# EAGLE schematic MikesLEDMatrix (EAGLE 5.12)
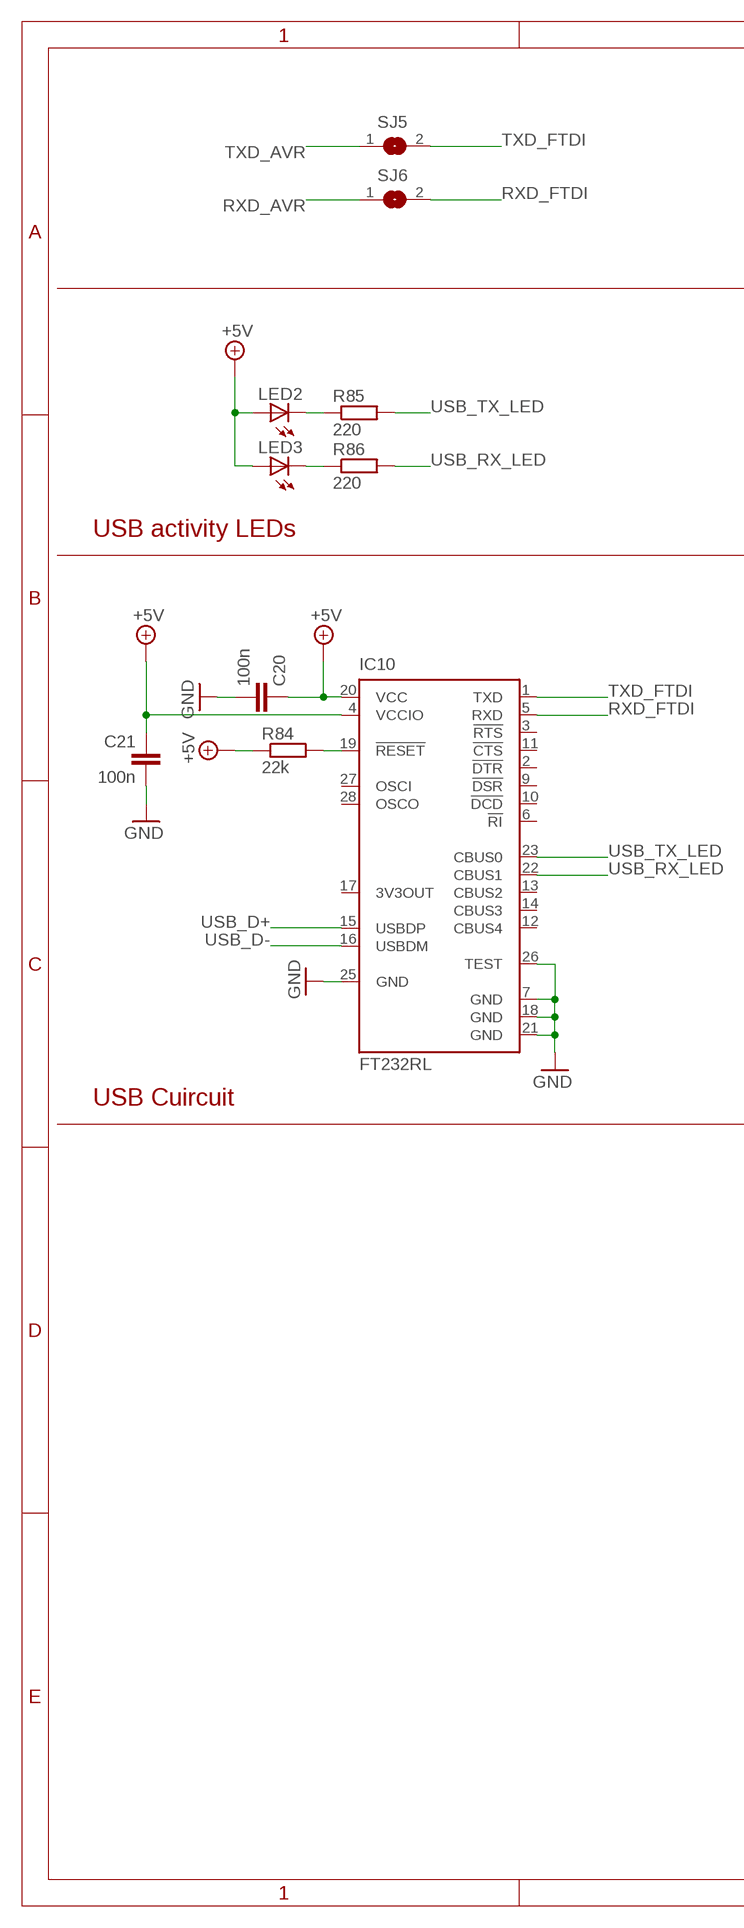
[diagram p0: schematic, sheet 1, part 1 of 2]
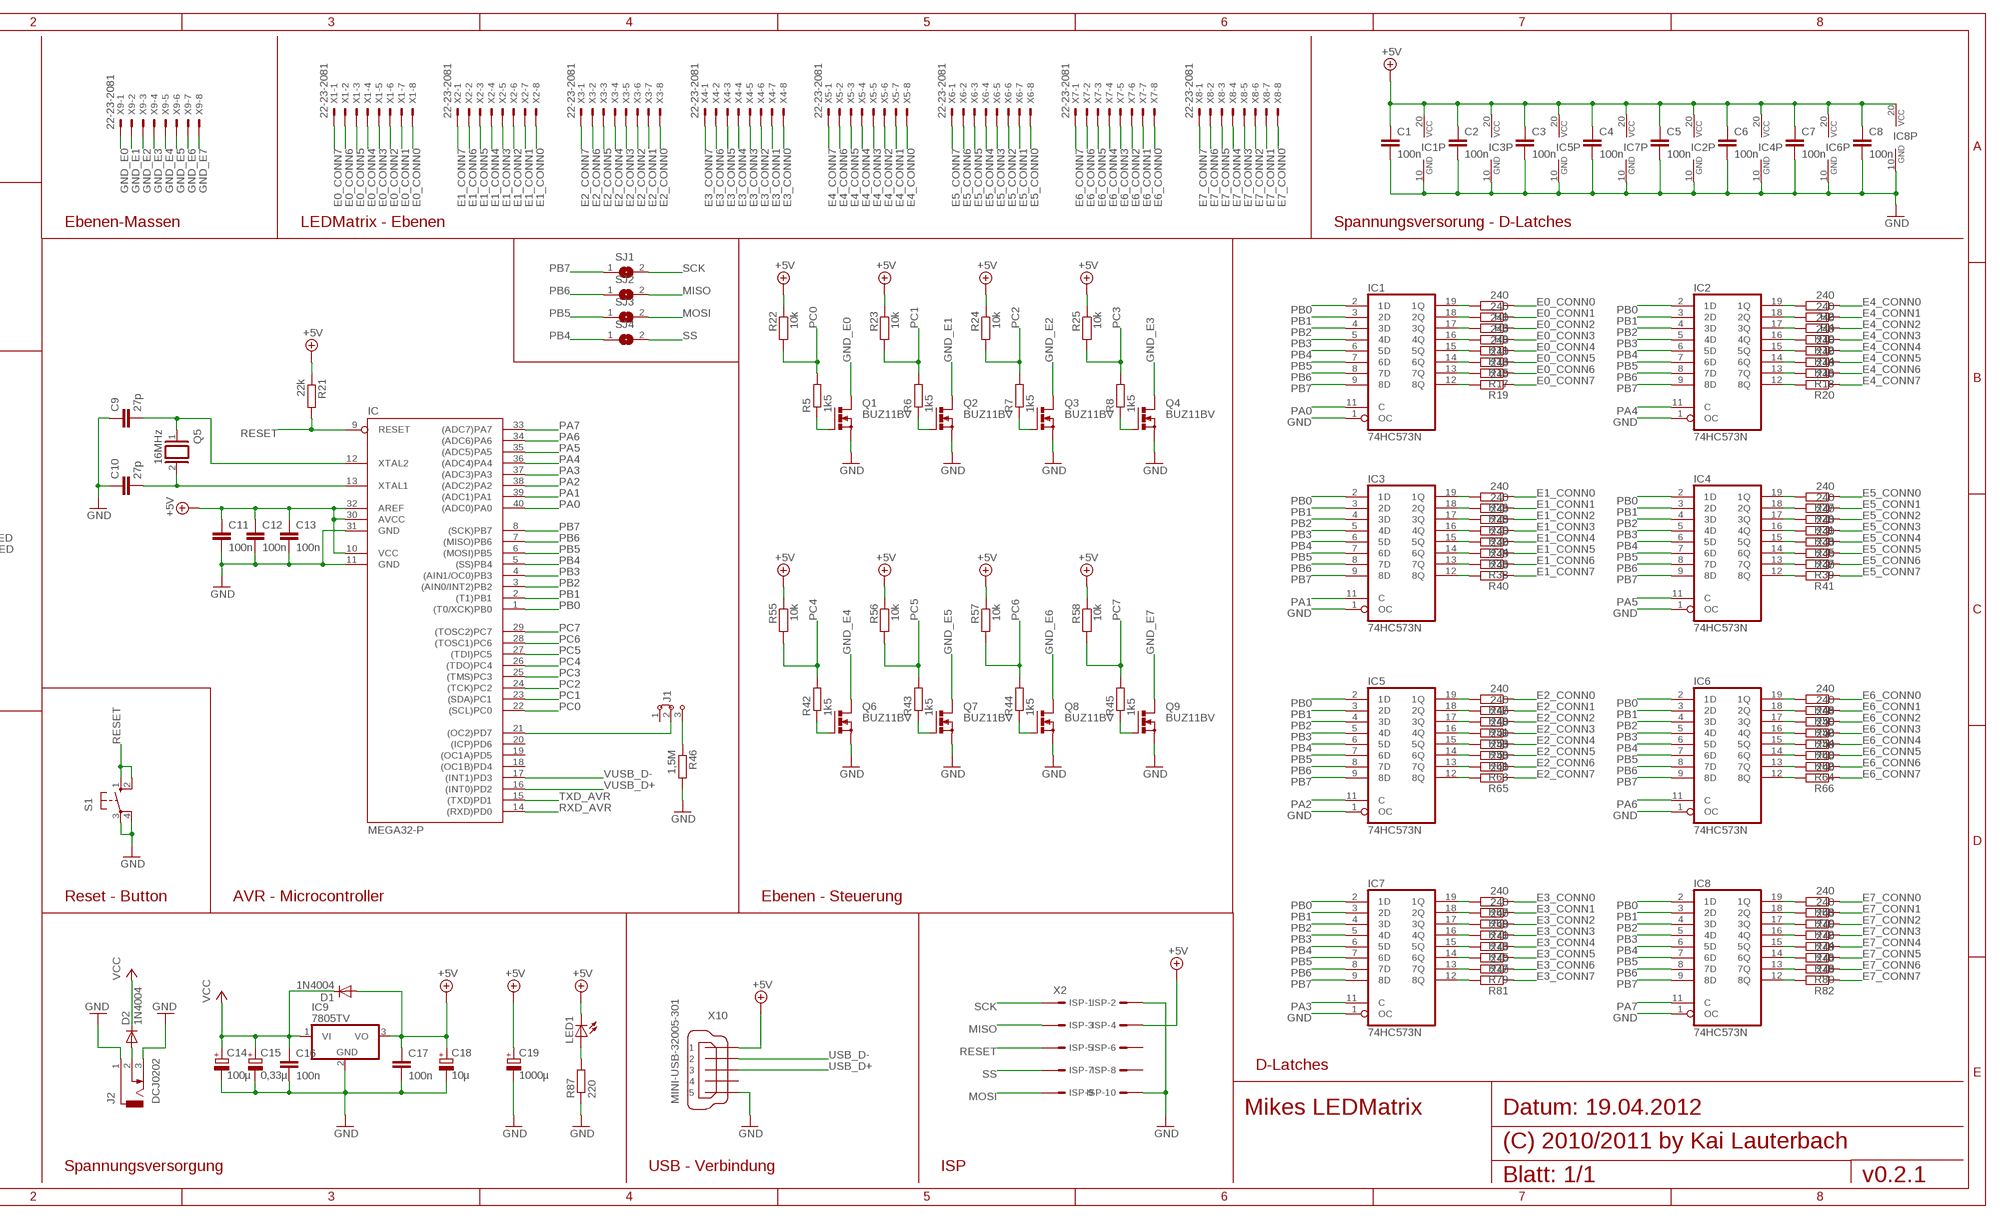
[diagram p1: schematic, sheet 1, part 2 of 2]

## Parts
C1  100n  C-EUC1206  [C1206]
C2  100n  C-EUC1206  [C1206]
C3  100n  C-EUC1206  [C1206]
C4  100n  C-EUC1206  [C1206]
C5  100n  C-EUC1206  [C1206]
C6  100n  C-EUC1206  [C1206]
C7  100n  C-EUC1206  [C1206]
C8  100n  C-EUC1206  [C1206]
C9  27p  C-EUC1206  [C1206]
C10  27p  C-EUC1206  [C1206]
C11  100n  C-EUC1206  [C1206]
C12  100n  C-EUC1206  [C1206]
C13  100n  C-EUC1206  [C1206]
C14  100µ  CPOL-EUE1.8-4  [E1,8-4]
C15  0,33µ  CPOL-EUE1.8-4  [E1,8-4]
C16  100n  C-EUC1206  [C1206]
C17  100n  C-EUC1206  [C1206]
C18  10µ  CPOL-EUE1.8-4  [E1,8-4]
C19  1000µ  CPOL-EUE1.8-4  [E1,8-4]
C20  100n  C-EUC1206  [C1206]
C21  100n  C-EUC1206  [C1206]
D1  1N4004  [DO41-10]
D2  1N4004  [DO41-10]
IC  MEGA32-P  [DIL40]
IC1  74HC573N  [DIL20]
IC2  74HC573N  [DIL20]
IC3  74HC573N  [DIL20]
IC4  74HC573N  [DIL20]
IC5  74HC573N  [DIL20]
IC6  74HC573N  [DIL20]
IC7  74HC573N  [DIL20]
IC8  74HC573N  [DIL20]
IC9  7805TV  [TO220V]
IC10  FT232RL  [SSOP28]
ISP  X2  057-010-1  [057-010-1]
J1  J2X2MM  [04C]
J2  DCJ0202  [DCJ0202]
LED1  LED3MM  [LED3MM]
LED2  LED3MM  [LED3MM]
LED3  LED3MM  [LED3MM]
Q1  BUZ11BV  [TO220BV]
Q2  BUZ11BV  [TO220BV]
Q3  BUZ11BV  [TO220BV]
Q4  BUZ11BV  [TO220BV]
Q5  16MHz  XTAL/S  [QS]
Q6  BUZ11BV  [TO220BV]
Q7  BUZ11BV  [TO220BV]
Q8  BUZ11BV  [TO220BV]
Q9  BUZ11BV  [TO220BV]
R1  240  R-EU_M1206  [M1206]
R2  240  R-EU_M1206  [M1206]
R3  240  R-EU_M1206  [M1206]
R4  240  R-EU_M1206  [M1206]
R5  1k5  R-EU_M1206  [M1206]
R6  1k5  R-EU_M1206  [M1206]
R7  1k5  R-EU_M1206  [M1206]
R8  1k5  R-EU_M1206  [M1206]
R9  240  R-EU_M1206  [M1206]
R10  240  R-EU_M1206  [M1206]
R11  240  R-EU_M1206  [M1206]
R12  240  R-EU_M1206  [M1206]
R13  240  R-EU_M1206  [M1206]
R14  240  R-EU_M1206  [M1206]
R15  240  R-EU_M1206  [M1206]
R16  240  R-EU_M1206  [M1206]
R17  240  R-EU_M1206  [M1206]
R18  240  R-EU_M1206  [M1206]
R19  240  R-EU_M1206  [M1206]
R20  240  R-EU_M1206  [M1206]
R21  22k  R-EU_M1206  [M1206]
R22  10k  R-EU_M1206  [M1206]
R23  10k  R-EU_M1206  [M1206]
R24  10k  R-EU_M1206  [M1206]
R25  10k  R-EU_M1206  [M1206]
R26  240  R-EU_M1206  [M1206]
R27  240  R-EU_M1206  [M1206]
R28  240  R-EU_M1206  [M1206]
R29  240  R-EU_M1206  [M1206]
R30  240  R-EU_M1206  [M1206]
R31  240  R-EU_M1206  [M1206]
R32  240  R-EU_M1206  [M1206]
R33  240  R-EU_M1206  [M1206]
R34  240  R-EU_M1206  [M1206]
R35  240  R-EU_M1206  [M1206]
R36  240  R-EU_M1206  [M1206]
R37  240  R-EU_M1206  [M1206]
R38  240  R-EU_M1206  [M1206]
R39  240  R-EU_M1206  [M1206]
R40  240  R-EU_M1206  [M1206]
R41  240  R-EU_M1206  [M1206]
R42  1k5  R-EU_M1206  [M1206]
R43  1k5  R-EU_M1206  [M1206]
R44  1k5  R-EU_M1206  [M1206]
R45  1k5  R-EU_M1206  [M1206]
R46  1,5M  R-EU_M1206  [M1206]
R47  240  R-EU_M1206  [M1206]
R48  240  R-EU_M1206  [M1206]
R49  240  R-EU_M1206  [M1206]
R50  240  R-EU_M1206  [M1206]
R51  240  R-EU_M1206  [M1206]
R52  240  R-EU_M1206  [M1206]
R53  240  R-EU_M1206  [M1206]
R54  240  R-EU_M1206  [M1206]
R55  10k  R-EU_M1206  [M1206]
R56  10k  R-EU_M1206  [M1206]
R57  10k  R-EU_M1206  [M1206]
R58  10k  R-EU_M1206  [M1206]
R59  240  R-EU_M1206  [M1206]
R60  240  R-EU_M1206  [M1206]
R61  240  R-EU_M1206  [M1206]
R62  240  R-EU_M1206  [M1206]
R63  240  R-EU_M1206  [M1206]
R64  240  R-EU_M1206  [M1206]
R65  240  R-EU_M1206  [M1206]
R66  240  R-EU_M1206  [M1206]
R67  240  R-EU_M1206  [M1206]
R68  240  R-EU_M1206  [M1206]
R69  240  R-EU_M1206  [M1206]
R70  240  R-EU_M1206  [M1206]
R71  240  R-EU_M1206  [M1206]
R72  240  R-EU_M1206  [M1206]
R73  240  R-EU_M1206  [M1206]
R74  240  R-EU_M1206  [M1206]
R75  240  R-EU_M1206  [M1206]
R76  240  R-EU_M1206  [M1206]
R77  240  R-EU_M1206  [M1206]
R78  240  R-EU_M1206  [M1206]
R79  240  R-EU_M1206  [M1206]
R80  240  R-EU_M1206  [M1206]
R81  240  R-EU_M1206  [M1206]
R82  240  R-EU_M1206  [M1206]
R84  22k  R-EU_M1206  [M1206]
R85  220  R-EU_M1206  [M1206]
R86  220  R-EU_M1206  [M1206]
R87  220  R-EU_M1206  [M1206]
S1  10-XX  [B3F-10XX]
SJ1  SJ  [SJ]
SJ2  SJ  [SJ]
SJ3  SJ  [SJ]
SJ4  SJ  [SJ]
SJ5  SJ  [SJ]
SJ6  SJ  [SJ]
X1  22-23-2081  [22-23-2081]
X2  22-23-2081  [22-23-2081]
X3  22-23-2081  [22-23-2081]
X4  22-23-2081  [22-23-2081]
X5  22-23-2081  [22-23-2081]
X6  22-23-2081  [22-23-2081]
X7  22-23-2081  [22-23-2081]
X8  22-23-2081  [22-23-2081]
X9  22-23-2081  [22-23-2081]
X10  MINI-USB-32005-301  [32005-301]

## Nets
+5V: C1.1 C2.1 C3.1 C4.1 C5.1 C6.1 C7.1 C8.1 C11.1 C12.1 C13.1 C17.1 C18.+ C19.+ C20.1 C21.1 D1.A IC1.20(VCC) IC2.20(VCC) IC3.20(VCC) IC4.20(VCC) IC5.20(VCC) IC6.20(VCC) IC7.20(VCC) IC8.20(VCC) IC9.3(VO) IC10.4(VCCIO) IC10.20(VCC) IC.10(VCC) IC.30(AVCC) IC.32(AREF) ISP.4 LED1.K(C) LED2.A LED3.A R21.1 R22.1 R23.1 R24.1 R25.1 R55.1 R56.1 R57.1 R58.1 R84.1 X10.1
E0_CONN0: R1.1 X1.8
E0_CONN1: R3.1 X1.7
E0_CONN2: R9.1 X1.6
E0_CONN3: R11.1 X1.5
E0_CONN4: R13.1 X1.4
E0_CONN5: R15.1 X1.3
E0_CONN6: R17.1 X1.2
E0_CONN7: R19.1 X1.1
E1_CONN0: R26.1 X2.8
E1_CONN1: R28.1 X2.7
E1_CONN2: R30.1 X2.6
E1_CONN3: R32.1 X2.5
E1_CONN4: R34.1 X2.4
E1_CONN5: R36.1 X2.3
E1_CONN6: R38.1 X2.2
E1_CONN7: R40.1 X2.1
E2_CONN0: R47.1 X3.8
E2_CONN1: R49.1 X3.7
E2_CONN2: R51.1 X3.6
E2_CONN3: R53.1 X3.5
E2_CONN4: R59.1 X3.4
E2_CONN5: R61.1 X3.3
E2_CONN6: R63.1 X3.2
E2_CONN7: R65.1 X3.1
E3_CONN0: R67.1 X4.8
E3_CONN1: R69.1 X4.7
E3_CONN2: R71.1 X4.6
E3_CONN3: R73.1 X4.5
E3_CONN4: R75.1 X4.4
E3_CONN5: R77.1 X4.3
E3_CONN6: R79.1 X4.2
E3_CONN7: R81.1 X4.1
E4_CONN0: R2.1 X5.8
E4_CONN1: R4.1 X5.7
E4_CONN2: R10.1 X5.6
E4_CONN3: R12.1 X5.5
E4_CONN4: R14.1 X5.4
E4_CONN5: R16.1 X5.3
E4_CONN6: R18.1 X5.2
E4_CONN7: R20.1 X5.1
E5_CONN0: R27.1 X6.8
E5_CONN1: R29.1 X6.7
E5_CONN2: R31.1 X6.6
E5_CONN3: R33.1 X6.5
E5_CONN4: R35.1 X6.4
E5_CONN5: R37.1 X6.3
E5_CONN6: R39.1 X6.2
E5_CONN7: R41.1 X6.1
E6_CONN0: R48.1 X7.8
E6_CONN1: R50.1 X7.7
E6_CONN2: R52.1 X7.6
E6_CONN3: R54.1 X7.5
E6_CONN4: R60.1 X7.4
E6_CONN5: R62.1 X7.3
E6_CONN6: R64.1 X7.2
E6_CONN7: R66.1 X7.1
E7_CONN0: R68.1 X8.8
E7_CONN1: R70.1 X8.7
E7_CONN2: R72.1 X8.6
E7_CONN3: R74.1 X8.5
E7_CONN4: R76.1 X8.4
E7_CONN5: R78.1 X8.3
E7_CONN6: R80.1 X8.2
E7_CONN7: R82.1 X8.1
GND: C1.2 C2.2 C3.2 C4.2 C5.2 C6.2 C7.2 C8.2 C9.1 C10.1 C11.2 C12.2 C13.2 C14.- C15.- C16.2 C17.2 C18.- C19.- C20.2 C21.2 IC1.1(OC) IC1.10(GND) IC2.1(OC) IC2.10(GND) IC3.1(OC) IC3.10(GND) IC4.1(OC) IC4.10(GND) IC5.1(OC) IC5.10(GND) IC6.1(OC) IC6.10(GND) IC7.1(OC) IC7.10(GND) IC8.1(OC) IC8.10(GND) IC9.2(GND) IC10.7(GND) IC10.18(GND) IC10.21(GND) IC10.25(GND) IC10.26(TEST) IC.11(GND) IC.31(GND) ISP.2 ISP.10 J2.1 J2.3 Q1.S Q2.S Q3.S Q4.S Q6.S Q7.S Q8.S Q9.S R46.2 R87.1 S1.3(P) S1.4(P1) X10.5
GND_E0: Q1.D X9.1
GND_E1: Q2.D X9.2
GND_E2: Q3.D X9.3
GND_E3: Q4.D X9.4
GND_E4: Q6.D X9.5
GND_E5: Q7.D X9.6
GND_E6: Q8.D X9.7
GND_E7: Q9.D X9.8
MISO: ISP.3 SJ2.2
MOSI: ISP.9 SJ3.2
N$1: C10.2 IC.13(XTAL1) Q5.2
N$2: IC.21((OC2)PD7) J1.2
N$3: C9.2 IC.12(XTAL2) Q5.1
N$4: J1.3 R46.1
N$5: IC10.19(!RESET) R84.2
N$6: D2.A J2.2
N$7: LED1.A R87.2
N$8: Q1.G R5.1
N$10: Q2.G R6.1
N$11: Q3.G R7.1
N$12: Q4.G R8.1
N$13: Q6.G R42.1
N$14: Q7.G R43.1
N$15: Q8.G R44.1
N$16: Q9.G R45.1
N$17: IC1.19(1Q) R1.2
N$18: IC1.18(2Q) R3.2
N$19: IC1.17(3Q) R9.2
N$20: IC1.16(4Q) R11.2
N$21: IC1.15(5Q) R13.2
N$22: IC1.14(6Q) R15.2
N$23: IC1.13(7Q) R17.2
N$24: IC1.12(8Q) R19.2
N$25: IC3.19(1Q) R26.2
N$26: IC3.18(2Q) R28.2
N$27: IC3.17(3Q) R30.2
N$28: IC3.16(4Q) R32.2
N$29: IC3.15(5Q) R34.2
N$30: IC3.14(6Q) R36.2
N$31: IC3.13(7Q) R38.2
N$32: IC3.12(8Q) R40.2
N$33: IC5.19(1Q) R47.2
N$34: IC5.18(2Q) R49.2
N$35: IC5.17(3Q) R51.2
N$36: IC5.16(4Q) R53.2
N$37: IC5.15(5Q) R59.2
N$38: IC5.14(6Q) R61.2
N$39: IC5.13(7Q) R63.2
N$40: IC5.12(8Q) R65.2
N$41: IC7.19(1Q) R67.2
N$42: IC7.18(2Q) R69.2
N$43: IC7.17(3Q) R71.2
N$44: IC7.16(4Q) R73.2
N$45: IC7.15(5Q) R75.2
N$46: IC7.14(6Q) R77.2
N$47: IC7.13(7Q) R79.2
N$48: IC7.12(8Q) R81.2
N$49: IC2.19(1Q) R2.2
N$50: IC2.18(2Q) R4.2
N$51: IC2.17(3Q) R10.2
N$52: IC2.16(4Q) R12.2
N$53: IC2.15(5Q) R14.2
N$54: IC2.14(6Q) R16.2
N$55: IC2.13(7Q) R18.2
N$56: IC2.12(8Q) R20.2
N$57: IC4.19(1Q) R27.2
N$58: IC4.18(2Q) R29.2
N$59: IC4.17(3Q) R31.2
N$60: IC4.16(4Q) R33.2
N$61: IC4.15(5Q) R35.2
N$62: IC4.14(6Q) R37.2
N$63: IC4.13(7Q) R39.2
N$64: IC4.12(8Q) R41.2
N$65: IC6.19(1Q) R48.2
N$66: IC6.18(2Q) R50.2
N$67: IC6.17(3Q) R52.2
N$68: IC6.16(4Q) R54.2
N$69: IC6.15(5Q) R60.2
N$70: IC6.14(6Q) R62.2
N$71: IC6.13(7Q) R64.2
N$72: IC6.12(8Q) R66.2
N$73: IC8.19(1Q) R68.2
N$74: IC8.18(2Q) R70.2
N$75: IC8.17(3Q) R72.2
N$76: IC8.16(4Q) R74.2
N$77: IC8.15(5Q) R76.2
N$78: IC8.14(6Q) R78.2
N$79: IC8.13(7Q) R80.2
N$80: IC8.12(8Q) R82.2
N$82: LED2.K(C) R85.1
N$83: LED3.K(C) R86.1
PA0: IC1.11(C) IC.40((ADC0)PA0)
PA1: IC3.11(C) IC.39((ADC1)PA1)
PA2: IC5.11(C) IC.38((ADC2)PA2)
PA3: IC7.11(C) IC.37((ADC3)PA3)
PA4: IC2.11(C) IC.36((ADC4)PA4)
PA5: IC4.11(C) IC.35((ADC5)PA5)
PA6: IC6.11(C) IC.34((ADC6)PA6)
PA7: IC8.11(C) IC.33((ADC7)PA7)
PB0: IC1.2(1D) IC2.2(1D) IC3.2(1D) IC4.2(1D) IC5.2(1D) IC6.2(1D) IC7.2(1D) IC8.2(1D) IC.1((T0/XCK)PB0)
PB1: IC1.3(2D) IC2.3(2D) IC3.3(2D) IC4.3(2D) IC5.3(2D) IC6.3(2D) IC7.3(2D) IC8.3(2D) IC.2((T1)PB1)
PB2: IC1.4(3D) IC2.4(3D) IC3.4(3D) IC4.4(3D) IC5.4(3D) IC6.4(3D) IC7.4(3D) IC8.4(3D) IC.3((AIN0/INT2)PB2)
PB3: IC1.5(4D) IC2.5(4D) IC3.5(4D) IC4.5(4D) IC5.5(4D) IC6.5(4D) IC7.5(4D) IC8.5(4D) IC.4((AIN1/OC0)PB3)
PB4: IC1.6(5D) IC2.6(5D) IC3.6(5D) IC4.6(5D) IC5.6(5D) IC6.6(5D) IC7.6(5D) IC8.6(5D) IC.5((SS)PB4) SJ4.1
PB5: IC1.7(6D) IC2.7(6D) IC3.7(6D) IC4.7(6D) IC5.7(6D) IC6.7(6D) IC7.7(6D) IC8.7(6D) IC.6((MOSI)PB5) SJ3.1
PB6: IC1.8(7D) IC2.8(7D) IC3.8(7D) IC4.8(7D) IC5.8(7D) IC6.8(7D) IC7.8(7D) IC8.8(7D) IC.7((MISO)PB6) SJ2.1
PB7: IC1.9(8D) IC2.9(8D) IC3.9(8D) IC4.9(8D) IC5.9(8D) IC6.9(8D) IC7.9(8D) IC8.9(8D) IC.8((SCK)PB7) SJ1.1
PC0: IC.22((SCL)PC0) R5.2 R22.2
PC1: IC.23((SDA)PC1) R6.2 R23.2
PC2: IC.24((TCK)PC2) R7.2 R24.2
PC3: IC.25((TMS)PC3) R8.2 R25.2
PC4: IC.26((TDO)PC4) R42.2 R55.2
PC5: IC.27((TDI)PC5) R43.2 R56.2
PC6: IC.28((TOSC1)PC6) R44.2 R57.2
PC7: IC.29((TOSC2)PC7) R45.2 R58.2
RESET: IC.9(RESET) ISP.5 R21.2 S1.1(S) S1.2(S1)
RXD_AVR: IC.14((RXD)PD0) SJ6.1
RXD_FTDI: IC10.5(RXD) SJ6.2
SCK: ISP.1 SJ1.2
SS: ISP.7 SJ4.2
TXD_AVR: IC.15((TXD)PD1) SJ5.1
TXD_FTDI: IC10.1(TXD) SJ5.2
USB_D+: IC10.15(USBDP) X10.3
USB_D-: IC10.16(USBDM) X10.2
USB_RX_LED: IC10.22(CBUS1) R86.2
USB_TX_LED: IC10.23(CBUS0) R85.2
VCC: C14.+ C15.+ C16.1 D1.C D2.C IC9.1(VI)
VUSB_D+: IC.16((INT0)PD2)
VUSB_D-: IC.17((INT1)PD3)
Unconnected: IC10.2(!DTR) IC10.3(!RTS) IC10.6(!RI) IC10.9(!DSR) IC10.10(!DCD) IC10.11(!CTS) IC10.12(CBUS4) IC10.13(CBUS2) IC10.14(CBUS3) IC10.17(3V3OUT) IC10.27(OSCI) IC10.28(OSCO) IC.18((OC1B)PD4) IC.19((OC1A)PD5) IC.20((ICP)PD6) ISP.6 ISP.8 J1.1 X10.4

## Notes on the sheet
- Ebenen-Massen | LEDMatrix - Ebenen | Spannungsversorung - D-Latches
- USB activity LEDs
- USB Cuircuit
- Reset - Button | AVR - Microcontroller | Ebenen - Steuerung
- D-Latches
- Mikes LEDMatrix | Datum: 19.04.2012
- (C) 2010/2011 by Kai Lauterbach
- Spannungsversorgung | USB - Verbindung | ISP
- Blatt: 1/1 | v0.2.1

## Library data of the parts
C1-C13 C16 C17 C20 C21 = rcl:C-EU: CAPACITOR, European symbol
C14 C15 C18 C19 = resistor:CPOL-EU: POLARIZED CAPACITOR, European symbol
D1 D2 = diode:1N4004: DIODE general purpose rectifier, 1 A
IC = atmel:MEGA32-P: MICROCONTROLLER 32 Kbytes FLASH 2 Kbytes SRAM 1 Kbytes EEPROM USART 8-channel 10 bit ADC Source: www.atmel.com .. doc2503.pdf; MPN: ATMEGA32-16PU; OC_FARNELL: 1661729; OC_NEWARK: 51P1794
IC1-IC8 = 74xx-eu:74*573: 8-bit D latch BUS DRIVER
IC9 = linear:78*: Positive VOLTAGE REGULATOR Source: http://cache.national.com/ds/LM/LM78L05.pdf http://www.fairchildsemi.com/ds/LM/LM7805.pdf
IC10 = ftdichip:FT232R: Source: http://www.ftdichip.com/Documents/DataSheets/DS_FT232R_v104.pdf; MPN: FT232RL; OC_FARNELL: 1146032; OC_NEWARK: 91K9918
ISP = con-panduit:057-010-: CONNECTOR 10-pin series 057 contact pc board low profile headers; OC_FARNELL: unknown; OC_NEWARK: unknown
J1 = jumper:J2: Jumper switch 2 x 2.5 mm
J2 = con-jack:DCJ0202: DC POWER JACK Source: DCJ0202.pdf; OC_FARNELL: unknown; OC_NEWARK: unknown
LED1-LED3 = led:LED: LED OSRAM: - CHIPLED LG R971, LG N971, LY N971, LG Q971, LY Q971, LO R971, LY R971 LH N974, LH R974 LS Q976, LO Q976, LY Q976 LO Q996 - Hyper CHIPLED LW Q18S LB Q993, LB Q99A, LB R99A - SideLED LS A670, LO A670, LY A670, LG A670, LP A670 LB A673, LV A673, LT A673, LW A673 LH A674 LY A675 LS A676, LA A676, LO A676, LY A676, LW A676 LS A679, LY A679, LG A679 - Hyper Micro SIDELED® LS Y876, LA Y876, LO Y876, LY Y876 LT Y87S - SmartLED LW L88C, LW L88S LB L89C, LB L89S, LG L890 LS L89K, LO L89K, LY L89K LS L896, LA L896, LO L896, LY L896 - TOPLED LS T670, LO T670, LY T670, LG T670, LP T670 LSG T670, LSP T670, LSY T670, LOP T670, LYG T670 LG T671, LOG T671, LSG T671 LB T673, LV T673, LT T673, LW T673 LH T674 LS T676, LA T676, LO T676, LY T676, LB T676, LH T676, LSB T676, LW T676 LB T67C, LV T67C, LT T67C, LS T67K, LO T67K, LY T67K, LW E67C LS E67B, LA E67B, LO E67B, LY E67B, LB E67C, LV E67C, LT E67C LW T67C LS T679, LY T679, LG T679 LS T770, LO T770, LY T770, LG T770, LP T770 LB T773, LV T773, LT T773, LW T773 LH T774 LS E675, LA E675, LY E675, LS T675 LS T776, LA T776, LO T776, LY T776, LB T776 LHGB T686 LT T68C, LB T68C - Hyper Mini TOPLED® LB M676 - Mini TOPLED Santana® LG M470 LS M47K, LO M47K, LY M47K Source: http://www.osram.convergy.de LUXEON: - LUMILED® LXK2-PW12-R00, LXK2-PW12-S00, LXK2-PW14-U00, LXK2-PW14-V00 LXK2-PM12-R00, LXK2-PM12-S00, LXK2-PM14-U00 LXK2-PE12-Q00, LXK2-PE12-R00, LXK2-PE12-S00, LXK2-PE14-T00, LXK2-PE14-U00 LXK2-PB12-K00, LXK2-PB12-L00, LXK2-PB12-M00, LXK2-PB14-N00, LXK2-PB14-P00, LXK2-PB14-Q00 LXK2-PR12-L00, LXK2-PR12-M00, LXK2-PR14-Q00, LXK2-PR14-R00 LXK2-PD12-Q00, LXK2-PD12-R00, LXK2-PD12-S00 LXK2-PH12-R00, LXK2-PH12-S00 LXK2-PL12-P00, LXK2-PL12-Q00, LXK2-PL12-R00 Source: www.luxeon.com KINGBRIGHT: KA-3528ASYC Source: www.kingbright.com
Q1-Q4 Q6-Q9 = transistor-power:BUZ11: N-CHANNEL MOS FET
Q5 = special:XTAL/S: CRYSTAL
R1-R82 R87 = rcl:R-EU_: RESISTOR, European symbol
R84-R86 = resistor:R-EU_: RESISTOR, European symbol
S1 = switch-omron:10-XX: OMRON SWITCH; MPN: B3F-1000; OC_FARNELL: 176432; OC_NEWARK: 36M3542
SJ1-SJ6 = jumper:SJ: SMD solder JUMPER
X1-X9 = con-molex:22-23-2081: .100" (2.54mm) Center Header - 8 Pin; MF: MOLEX; MPN: 22-23-2081; OC_FARNELL: 1756826; OC_NEWARK: 01C7592
X10 = con-cypressindustries:MINI-USB-: MINI USB-B Conector Source: www.cypressindustries.com; OC_FARNELL: unknown; OC_NEWARK: unknown